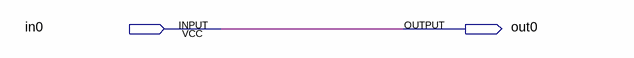
[diagram p0: schematic sheet]
// Quartus schematic 123.bdf as structural Verilog: 0 symbols, 2 pins
module \123  (
  input  in0,
  output out0
);


  assign out0 = in0;
endmodule
